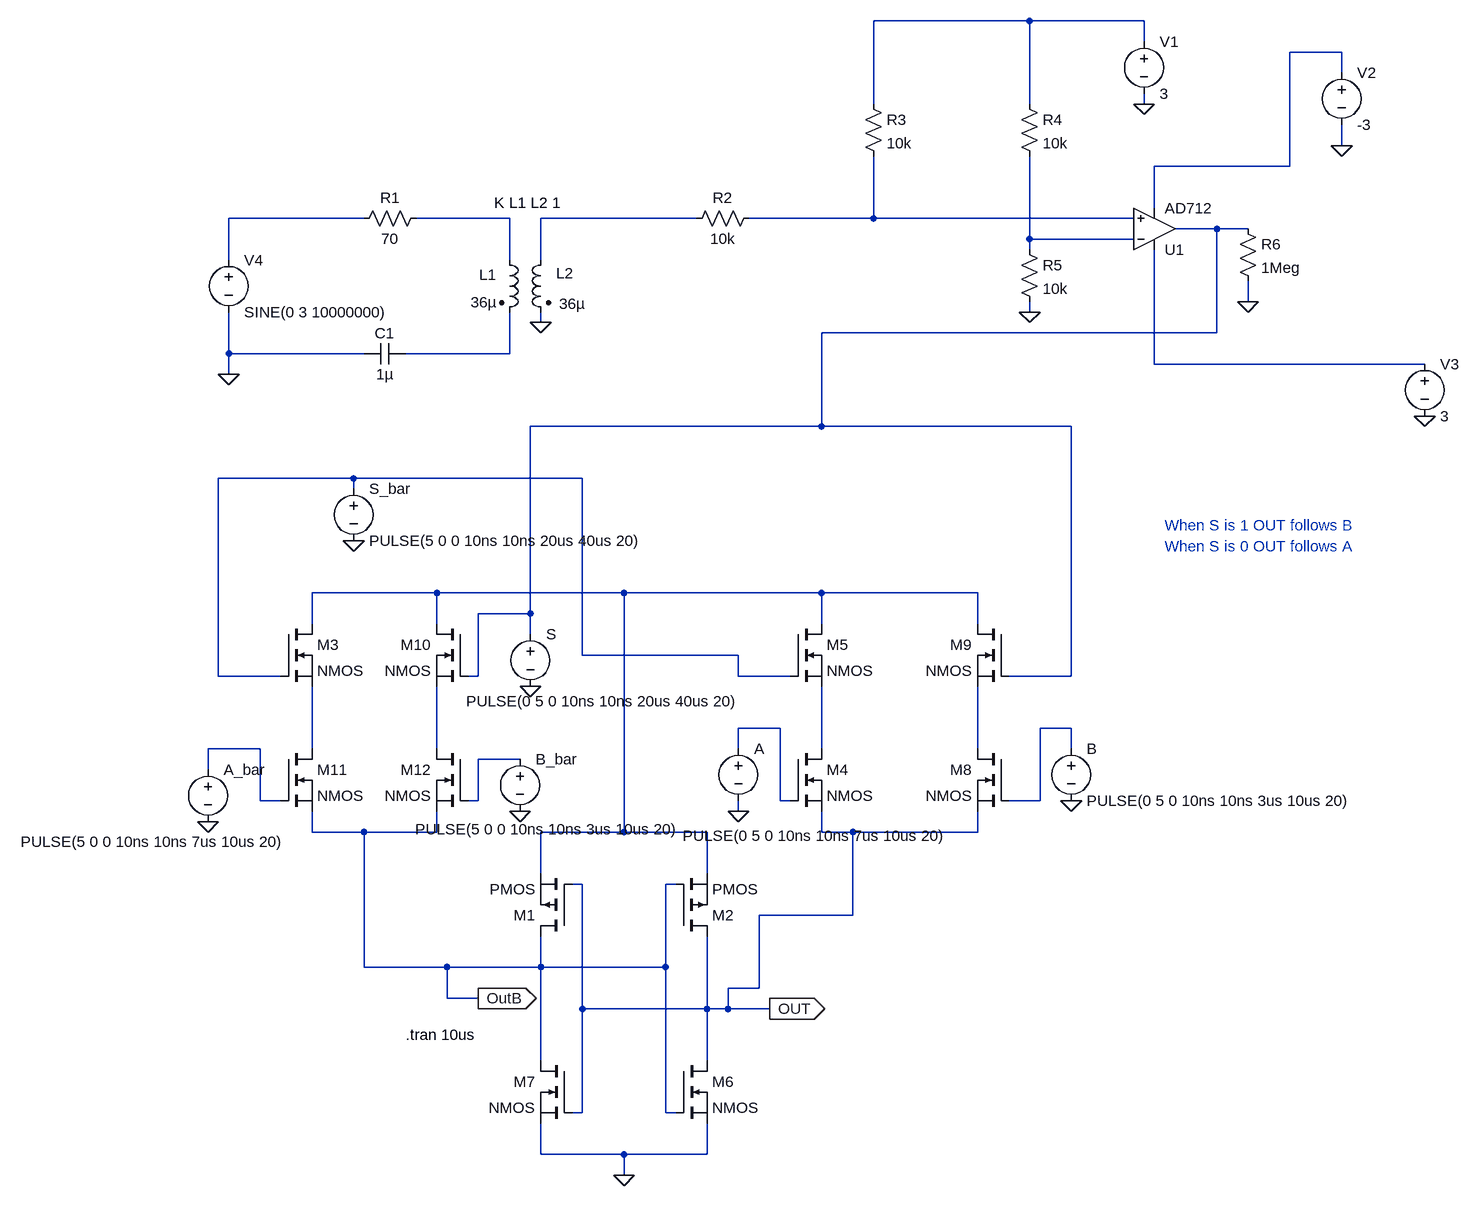
[diagram p0: schematic mux1_original.asc]
mux1_original.asc, the LTspice schematic file:
Version 4
SHEET 1 1648 680
WIRE 912 -1216 672 -1216
WIRE 1088 -1216 912 -1216
WIRE 1088 -1184 1088 -1216
WIRE 1392 -1168 1312 -1168
WIRE 1392 -1136 1392 -1168
WIRE 672 -1088 672 -1216
WIRE 912 -1088 912 -1216
WIRE 1088 -1088 1088 -1104
WIRE 1392 -1024 1392 -1056
WIRE 1312 -992 1312 -1168
WIRE 1312 -992 1104 -992
WIRE 1104 -928 1104 -992
WIRE -112 -912 -320 -912
WIRE 112 -912 -32 -912
WIRE 400 -912 160 -912
WIRE 672 -912 672 -1008
WIRE 672 -912 480 -912
WIRE 1072 -912 672 -912
WIRE 1200 -896 1136 -896
WIRE 1248 -896 1200 -896
WIRE 912 -880 912 -1008
WIRE 1072 -880 912 -880
WIRE 912 -864 912 -880
WIRE -320 -848 -320 -912
WIRE 112 -848 112 -912
WIRE 160 -848 160 -912
WIRE 1248 -784 1248 -816
WIRE 912 -768 912 -784
WIRE 160 -752 160 -768
WIRE 1200 -736 1200 -896
WIRE 1200 -736 592 -736
WIRE -320 -704 -320 -768
WIRE -112 -704 -320 -704
WIRE 112 -704 112 -768
WIRE 112 -704 -48 -704
WIRE 1104 -688 1104 -864
WIRE 1520 -688 1104 -688
WIRE -320 -672 -320 -704
WIRE 592 -592 592 -736
WIRE 592 -592 144 -592
WIRE 976 -592 592 -592
WIRE -128 -512 -336 -512
WIRE 224 -512 -128 -512
WIRE -128 -496 -128 -512
WIRE 0 -336 -192 -336
WIRE 288 -336 0 -336
WIRE 592 -336 288 -336
WIRE 832 -336 592 -336
WIRE 144 -304 144 -592
WIRE 144 -304 64 -304
WIRE -192 -288 -192 -336
WIRE 0 -288 0 -336
WIRE 592 -288 592 -336
WIRE 832 -288 832 -336
WIRE 144 -272 144 -304
WIRE 224 -240 224 -512
WIRE 464 -240 224 -240
WIRE -336 -208 -336 -512
WIRE -240 -208 -336 -208
WIRE 64 -208 64 -304
WIRE 64 -208 48 -208
WIRE 464 -208 464 -240
WIRE 544 -208 464 -208
WIRE 976 -208 976 -592
WIRE 976 -208 880 -208
WIRE 528 -128 464 -128
WIRE 976 -128 928 -128
WIRE -272 -96 -352 -96
WIRE -192 -96 -192 -192
WIRE 0 -96 0 -192
WIRE 464 -96 464 -128
WIRE 592 -96 592 -192
WIRE 832 -96 832 -192
WIRE 976 -96 976 -128
WIRE 128 -80 64 -80
WIRE -352 -64 -352 -96
WIRE -272 -16 -272 -96
WIRE -240 -16 -272 -16
WIRE 64 -16 64 -80
WIRE 64 -16 48 -16
WIRE 528 -16 528 -128
WIRE 544 -16 528 -16
WIRE 928 -16 928 -128
WIRE 928 -16 880 -16
WIRE 464 0 464 -16
WIRE -192 32 -192 0
WIRE -112 32 -192 32
WIRE 0 32 0 0
WIRE 0 32 -112 32
WIRE 288 32 288 -336
WIRE 288 32 160 32
WIRE 416 32 288 32
WIRE 592 32 592 0
WIRE 640 32 592 32
WIRE 832 32 832 0
WIRE 832 32 640 32
WIRE 160 96 160 32
WIRE 416 96 416 32
WIRE 224 112 208 112
WIRE 368 112 352 112
WIRE 640 160 640 32
WIRE 640 160 496 160
WIRE -112 240 -112 32
WIRE 16 240 -112 240
WIRE 160 240 160 192
WIRE 160 240 16 240
WIRE 352 240 352 112
WIRE 352 240 160 240
WIRE 496 272 496 160
WIRE 496 272 448 272
WIRE 16 288 16 240
WIRE 64 288 16 288
WIRE 224 304 224 112
WIRE 416 304 416 192
WIRE 416 304 224 304
WIRE 448 304 448 272
WIRE 448 304 416 304
WIRE 512 304 448 304
WIRE 160 384 160 240
WIRE 416 384 416 304
WIRE 224 464 224 304
WIRE 224 464 208 464
WIRE 352 464 352 240
WIRE 368 464 352 464
WIRE 160 528 160 480
WIRE 288 528 160 528
WIRE 416 528 416 480
WIRE 416 528 288 528
WIRE 288 560 288 528
FLAG 288 560 0
FLAG -352 16 0
FLAG -128 -416 0
FLAG 144 -192 0
FLAG 128 0 0
FLAG 464 0 0
FLAG 976 -16 0
FLAG 64 288 OutB
IOPIN 64 288 Out
FLAG 512 304 OUT
IOPIN 512 304 Out
FLAG 160 -752 0
FLAG -320 -672 0
FLAG 1520 -608 0
FLAG 1392 -1024 0
FLAG 1088 -1088 0
FLAG 912 -768 0
FLAG 1248 -784 0
SYMBOL pmos 208 192 R180
SYMATTR InstName M1
SYMBOL pmos 368 192 M180
SYMATTR InstName M2
SYMBOL nmos -240 -288 R0
SYMATTR InstName M3
SYMBOL nmos 544 -96 R0
SYMATTR InstName M4
SYMBOL nmos 544 -288 R0
SYMATTR InstName M5
SYMBOL nmos 368 384 R0
SYMATTR InstName M6
SYMBOL nmos 208 384 M0
SYMATTR InstName M7
SYMBOL nmos 880 -96 M0
SYMATTR InstName M8
SYMBOL nmos 880 -288 M0
SYMATTR InstName M9
SYMBOL nmos 48 -288 M0
SYMATTR InstName M10
SYMBOL nmos -240 -96 R0
SYMATTR InstName M11
SYMBOL nmos 48 -96 M0
SYMATTR InstName M12
SYMBOL voltage 976 -112 R0
WINDOW 123 0 0 Left 0
WINDOW 39 0 0 Left 0
SYMATTR InstName B
SYMATTR Value PULSE(0 5 0 10ns 10ns 3us 10us 20)
SYMBOL voltage 144 -288 R0
WINDOW 3 -99 119 Left 2
WINDOW 123 0 0 Left 0
WINDOW 39 0 0 Left 0
SYMATTR Value PULSE(0 5 0 10ns 10ns 20us 40us 20)
SYMATTR InstName S
SYMBOL voltage -128 -512 R0
WINDOW 123 0 0 Left 0
WINDOW 39 0 0 Left 0
SYMATTR InstName S_bar
SYMATTR Value PULSE(5 0 0 10ns 10ns 20us 40us 20)
SYMBOL voltage -352 -80 R0
WINDOW 3 -288 127 Left 2
WINDOW 123 0 0 Left 0
WINDOW 39 0 0 Left 0
SYMATTR Value PULSE(5 0 0 10ns 10ns 7us 10us 20)
SYMATTR InstName A_bar
SYMBOL voltage 464 -112 R0
WINDOW 3 -86 150 Left 2
WINDOW 123 0 0 Left 0
WINDOW 39 0 0 Left 0
SYMATTR Value PULSE(0 5 0 10ns 10ns 7us 10us 20)
SYMATTR InstName A
SYMBOL voltage 128 -96 R0
WINDOW 3 -161 124 Left 2
WINDOW 123 0 0 Left 0
WINDOW 39 0 0 Left 0
SYMATTR Value PULSE(5 0 0 10ns 10ns 3us 10us 20)
SYMATTR InstName B_bar
SYMBOL ind2 96 -864 R0
WINDOW 0 -31 39 Left 2
WINDOW 3 -44 81 Left 2
SYMATTR InstName L1
SYMATTR Value 36µ
SYMATTR Type ind
SYMBOL ind2 176 -864 M0
WINDOW 0 -35 36 Left 2
WINDOW 3 -53 83 Left 2
SYMATTR InstName L2
SYMATTR Value 36µ
SYMATTR Type ind
SYMBOL cap -48 -720 R90
WINDOW 0 0 32 VBottom 2
WINDOW 3 32 32 VTop 2
SYMATTR InstName C1
SYMATTR Value 1µ
SYMBOL res -16 -928 R90
WINDOW 0 0 56 VBottom 2
WINDOW 3 32 56 VTop 2
SYMATTR InstName R1
SYMATTR Value 70
SYMBOL res 496 -928 R90
WINDOW 0 0 56 VBottom 2
WINDOW 3 32 56 VTop 2
SYMATTR InstName R2
SYMATTR Value 10k
SYMBOL res 656 -1104 R0
SYMATTR InstName R3
SYMATTR Value 10k
SYMBOL res 896 -1104 R0
SYMATTR InstName R4
SYMATTR Value 10k
SYMBOL res 896 -880 R0
SYMATTR InstName R5
SYMATTR Value 10k
SYMBOL res 1232 -912 R0
SYMATTR InstName R6
SYMATTR Value 1Meg
SYMATTR SpiceLine tol=1 pwr=0.1
SYMBOL OpAmps\\AD712 1104 -832 M180
SYMATTR InstName U1
SYMBOL voltage 1088 -1200 R0
WINDOW 123 0 0 Left 0
WINDOW 39 0 0 Left 0
SYMATTR InstName V1
SYMATTR Value 3
SYMBOL voltage 1392 -1152 R0
WINDOW 123 0 0 Left 0
WINDOW 39 0 0 Left 0
SYMATTR InstName V2
SYMATTR Value -3
SYMBOL voltage 1520 -704 R0
WINDOW 123 0 0 Left 0
WINDOW 39 0 0 Left 0
SYMATTR InstName V3
SYMATTR Value 3
SYMBOL voltage -320 -864 R0
WINDOW 123 0 0 Left 0
WINDOW 39 0 0 Left 0
SYMATTR InstName V4
SYMATTR Value SINE(0 3 10000000)
TEXT -48 344 Left 2 !.tran 10us
TEXT 1120 -440 Left 2 ;When S is 1 OUT follows B
TEXT 1120 -408 Left 2 ;When S is 0 OUT follows A
TEXT 88 -936 Left 2 !K L1 L2 1

The netlist it stands for:
* mux1_original.asc
M1 OutB OUT N012 N012 PMOS
M2 OUT OutB N012 N012 PMOS
M3 N012 N011 N016 N016 NMOS
M4 N018 N013 OUT OUT NMOS
M5 N012 N011 N018 N018 NMOS
M6 OUT OutB 0 0 NMOS
M7 OutB OUT 0 0 NMOS
M8 N019 N014 OUT OUT NMOS
M9 N012 N007 N019 N019 NMOS
M10 N012 N007 N017 N017 NMOS
M11 N016 N015 OutB OutB NMOS
M12 N017 N020 OutB OutB NMOS
V§B N014 0 PULSE(0 5 0 10ns 10ns 3us 10us 20)
V§S N007 0 PULSE(0 5 0 10ns 10ns 20us 40us 20)
V§S_bar N011 0 PULSE(5 0 0 10ns 10ns 20us 40us 20)
V§A_bar N015 0 PULSE(5 0 0 10ns 10ns 7us 10us 20)
V§A N013 0 PULSE(0 5 0 10ns 10ns 7us 10us 20)
V§B_bar N020 0 PULSE(5 0 0 10ns 10ns 3us 10us 20)
L1 N004 N009 36µ
L2 N005 0 36µ
C1 N009 0 1µ
R1 N004 N003 70
R2 N006 N005 10k
R3 N001 N006 10k
R4 N001 N008 10k
R5 N008 0 10k
R6 N007 0 1Meg tol=1 pwr=0.1
XU1 N006 N008 N010 N002 N007 AD712  ; pins In+ In- V+ V- OUT
V1 N001 0 3
V2 N002 0 -3
V3 N010 0 3
V4 N003 0 SINE(0 3 10000000)
.model NMOS NMOS
.model PMOS PMOS
.lib standard.mos
.tran 10us
* When S is 1 OUT follows B
* When S is 0 OUT follows A
K L1 L2 1
.backanno
.end